# Altium schematic sheet ClipBoard.SchDoc
size A4
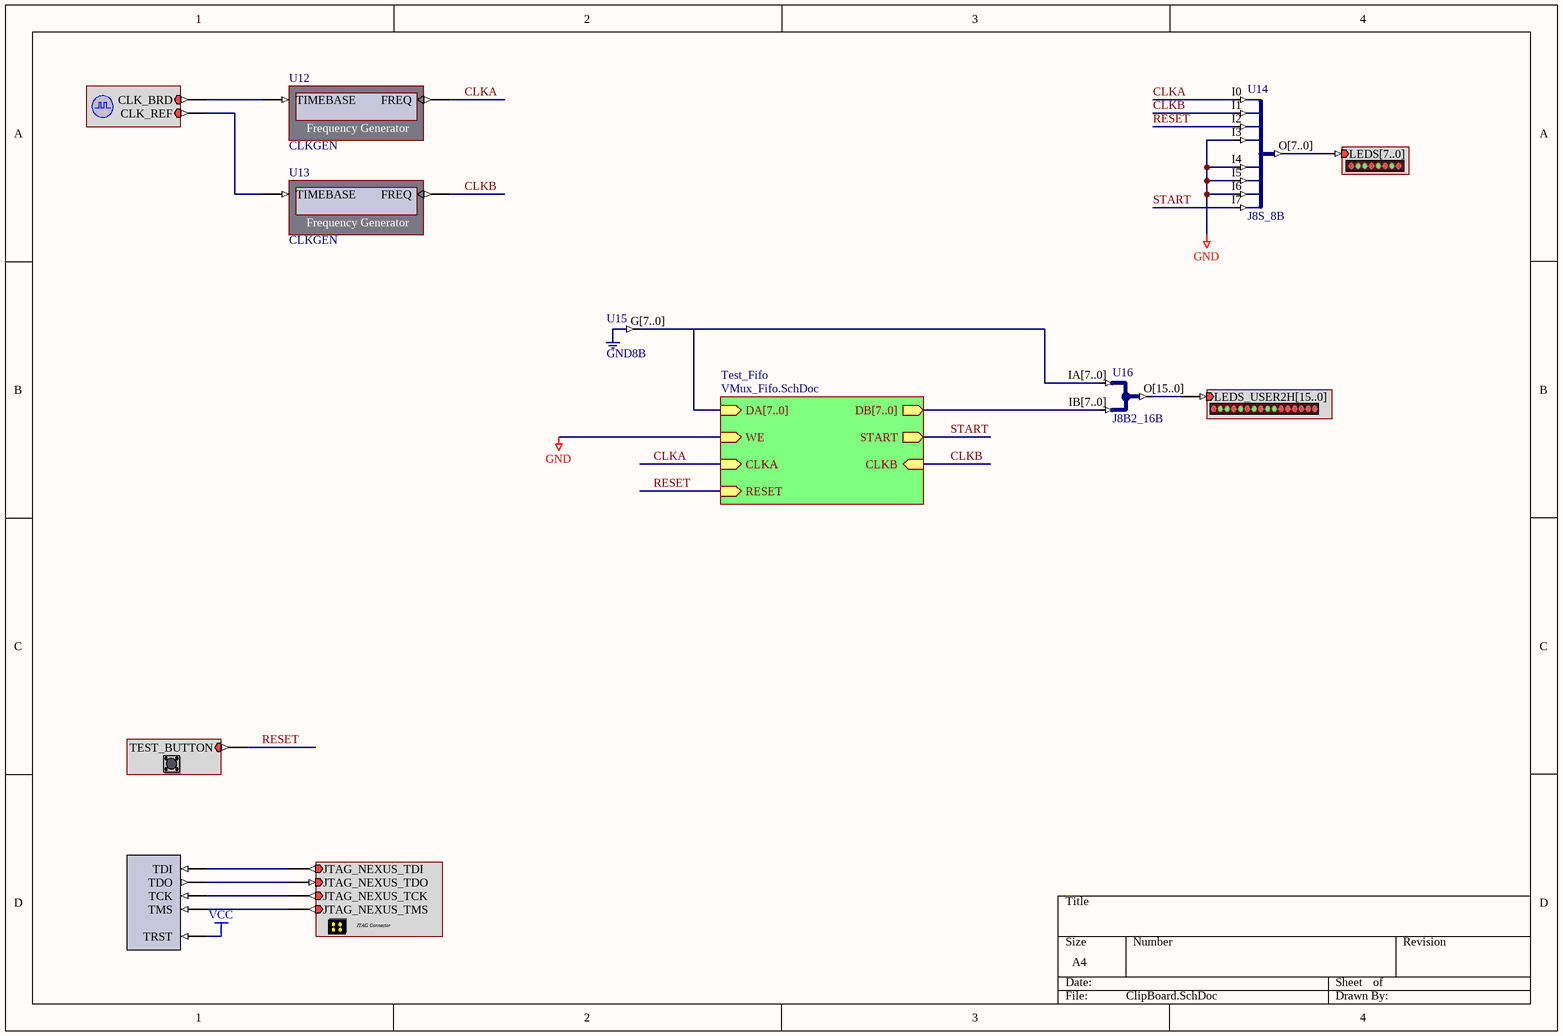
[diagram p0: ClipBoard.SchDoc]

## Parts
(Parts that share a designator on the sheet are numbered #1, #2 ... from top to bottom, then left to right.)
?#1  LEDX16USERIO2  (value not drawn)
?#2  CLOCK_SUPPLY  (value not drawn)
?#3  LED  (value not drawn)
?#4  TEST_BUTTON  (value not drawn)
?#5  NEXUS_JTAG_PORT  (value not drawn)
?#6  NEXUS_JTAG_CONNECTOR  (value not drawn)
U12  CLKGEN
U13  CLKGEN
U14  J8S_8B
U15  GND8B
U16  J8B2_16B

## Sub-sheets
Test_Fifo = VMux_Fifo.SchDoc: DA[7..0] (in), CLKA (in), WE (in), START (out), DB[7..0] (out), CLKB (in), RESET (in)

## Nets
GND: U14.I3 U14.I4 U14.I5 U14.I6 ; sheet Test_Fifo/WE
VCC: ?#5.TRST
CLKA: U12.FREQ U14.I0 ; sheet Test_Fifo/CLKA
CLKB: U13.FREQ U14.I1 ; sheet Test_Fifo/CLKB
RESET: ?#4.TEST_BUTTON U14.I2 ; sheet Test_Fifo/RESET
START: U14.I7 ; sheet Test_Fifo/START
Net?#1_LEDS_USER2H[15..0]: ?#1.LEDS_USER2H[15..0] U16.O[15..0]
Net?#2_CLK_BRD: ?#2.CLK_BRD U12.TIMEBASE
Net?#2_CLK_REF: ?#2.CLK_REF U13.TIMEBASE
Net?#3_LEDS[7..0]: ?#3.LEDS[7..0] U14.O[7..0]
Net?#5_TCK: ?#5.TCK ?#6.JTAG_NEXUS_TCK
Net?#5_TDI: ?#5.TDI ?#6.JTAG_NEXUS_TDI
Net?#5_TDO: ?#5.TDO ?#6.JTAG_NEXUS_TDO
Net?#5_TMS: ?#5.TMS ?#6.JTAG_NEXUS_TMS
NetU15_G[7..0]: U15.G[7..0] U16.IA[7..0] ; sheet Test_Fifo/DA[7..0]
NetU16_IB[7..0]: U16.IB[7..0] ; sheet Test_Fifo/DB[7..0]

## Notes on the sheet
- (in symbol NEXUS_JTAG_CONNECTOR) JTAG Connector

## Library data of the parts
?#1 = LEDX16USERIO2: 16x LED User Module; PortComponent: True; Published: 5-Sep-2003; Publisher: Altium Hobart Technology Centre
?#2 = CLOCK_SUPPLY: Global System Clock and Reference Suply; PortComponent: True; Published: 5-Sep-2003; Publisher: Altium Hobart Technology Centre
?#3 = LED: 8-Way LEDS; PortComponent: True; Published: 5-Sep-2003; Publisher: Altium Hobart Technology Centre
?#4 = TEST_BUTTON: Test Button; PortComponent: True; Published: 5-Sep-2003; Publisher: Altium Hobart Technology Centre
?#5 = NEXUS_JTAG_PORT: Nexus Processor JTAG Chain Connector; NEXUS_JTAG_CONNECTOR: True; Published: 5-Sep-2003; Publisher: Altium Hobart Technology Centre
?#6 = NEXUS_JTAG_CONNECTOR: JTAG Port; PortComponent: True; Published: 5-Sep-2003; Publisher: Altium Hobart Technology Centre
U12 U13 = CLKGEN: Frequency Generator; NEXUS_CORE: Instrument; NEXUS_JTAG_DEVICE: True; NEXUS_JTAG_ORDER: 0; Published: 30/09/2003; Publisher: Altium Hobart Technology Centre; Core Revision: 1.00.00
U14 = J8S_8B: 8 Single pin inputs to single 8-Bit output bus; Class I: Bus Joiner; ArchiveName: GENERIC; Published: 18-Sep-2003; Publisher: Altium Limited
U15 = GND8B: 8-Bit Logic '0' Bus; Class I: Power Level; ArchiveName: GENERIC; Published: 18-Sep-2003; Publisher: Altium Limited
U16 = J8B2_16B: 2 x 8-Bit input bus to 1 x 16-bit output bus; Class I: Bus Joiner; ArchiveName: GENERIC; Published: 18-Sep-2003; Publisher: Altium Limited